# EAGLE design rotary-control (EAGLE 9.6.2)
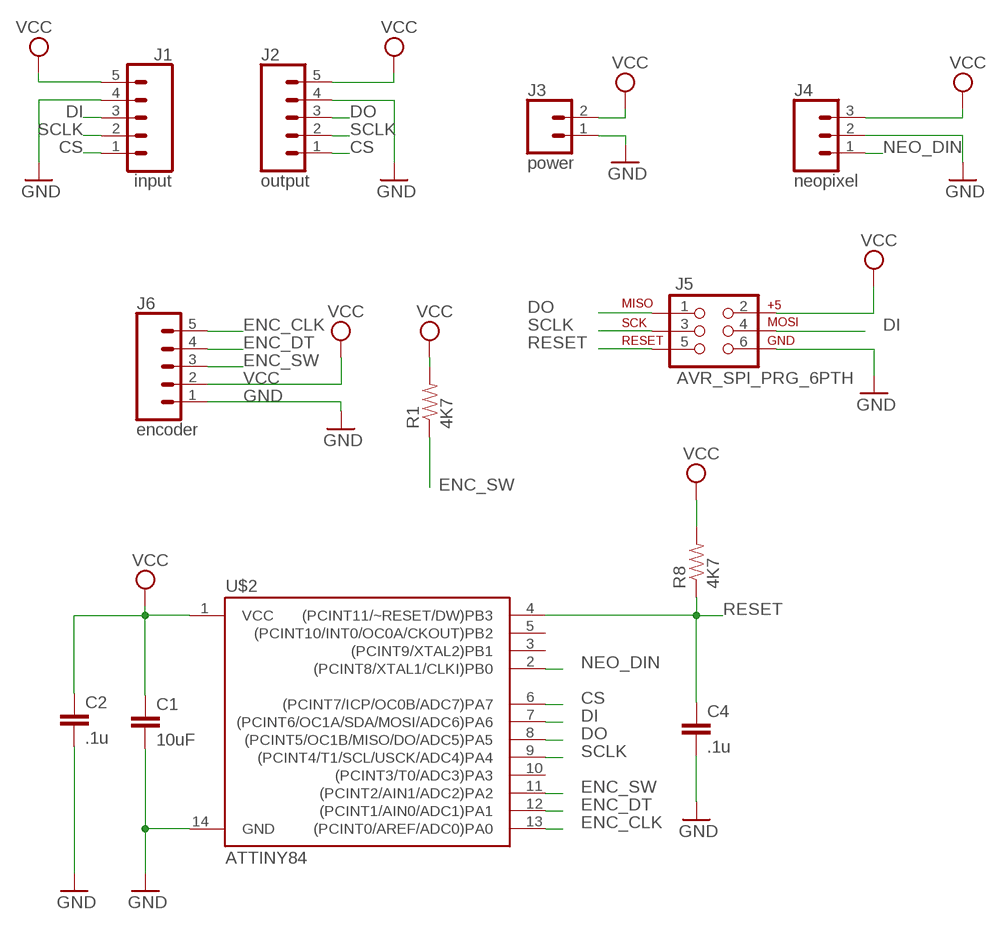
[diagram p0: schematic, sheet 1]

## Parts
C1  10uF  10UF-1206-6.3V-20%  [1206]
C2  .1u  CAP0805  [0805]
C4  .1u  CAP0805  [0805]
J1  input  CONN_05  [1X05]
J2  output  CONN_05  [1X05]
J3  power  CONN_02  [1X02]
J4  neopixel  CONN_03  [1X03]
J5  AVR_SPI_PRG_6PTH  [2X3]
J6  encoder  CONN_05  [1X05]
R1  4K7  RESISTOR  [0805]
R8  4K7  RESISTOR  [0805]
U$2  ATTINY84  [SO14]

## Nets
CS: J1.1 J2.1 U$2.6((PCINT7/ICP/OC0B/ADC7)PA7)
DI: J1.3 J5.4 U$2.7((PCINT6/OC1A/SDA/MOSI/ADC6)PA6)
DO: J2.3 J5.1 U$2.8((PCINT5/OC1B/MISO/DO/ADC5)PA5)
ENC_CLK: J6.5 U$2.13((PCINT0/AREF/ADC0)PA0)
ENC_DT: J6.4 U$2.12((PCINT1/AIN0/ADC1)PA1)
ENC_SW: J6.3 R1.1 U$2.11((PCINT2/AIN1/ADC2)PA2)
GND: C1.2 C2.2 C4.2 J1.4 J2.4 J3.1 J4.2 J5.6 J6.1 U$2.14(GND)
NEO_DIN: J4.1 U$2.2((PCINT8/XTAL1/CLKI)PB0)
RESET: C4.1 J5.5 R8.1 U$2.4((PCINT11/~RESET/DW)PB3)
SCLK: J1.2 J2.2 J5.3 U$2.9((PCINT4/T1/SCL/USCK/ADC4)PA4)
VCC: C1.1 C2.1 J1.5 J2.5 J3.2 J4.3 J5.2 J6.2 R1.2 R8.2 U$2.1(VCC)
Unconnected: U$2.3((PCINT9/XTAL2)PB1) U$2.5((PCINT10/INT0/OC0A/CKOUT)PB2) U$2.10((PCINT3/T0/ADC3)PA3)

## Library data of the parts
C1 = SparkFun-Capacitors:10UF: 10.0µF ceramic capacitors A capacitor is a passive two-terminal electrical component used to store electrical energy temporarily in an electric field.; PROD_ID: CAP-10057
C2 C4 = SparkFun:CAP: Capacitor Standard 0603 ceramic capacitor, and 0.1" leaded capacitor.
J1 J2 J6 = SparkFun-Connectors:CONN_05: Multi connection point. Often used as Generic Header-pin footprint for 0.1 inch spaced/style header connections On any of the 0.1 inch spaced packages, you can populate with these: Break Away Headers - Straight <https://www.sparkfun.com/products/116> (PRT-00116) Break Away Male Headers - Right Angle <https://www.sparkfun.com/products/553> (PRT-00553) Female Headers <https://www.sparkfun.com/products/115> (PRT-00115) Break Away Headers - Machine Pin <https://www.sparkfun.com/products/117> (PRT-00117) Break Away Female Headers - Swiss Machine Pin <https://www.sparkfun.com/products/743> (PRT-00743) For SCREWTERMINALS and SPRING TERMINALS visit here: Screw Terimnals on SparkFun.com <https://www.sparkfun.com/search/results?term=Screw+Terminals> (5mm/3.5mm/2.54mm spacing) This device is also useful as a general connection point to wire up your design to another part of your project. Our various solder wires solder well into these plated through hole pads. Hook-Up Wire - Assortment (Stranded, 22 AWG) <https://www.sparkfun.com/products/11375> (PRT-11375) Hook-Up Wire - Assortment (Solid Core, 22 AWG) <https://www.sparkfun.com/products/11367> (PRT-11367) View the entire wire category on our website here <https://www.sparkfun.com/categories/141> Special notes: Molex polarized connector foot print use with SKU : PRT-08231 with associated crimp pins and housings. 1MM SMD Version SKU: PRT-10208
J3 = SparkFun-Connectors:CONN_02: Multi connection point. Often used as Generic Header-pin footprint for 0.1 inch spaced/style header connections On any of the 0.1 inch spaced packages, you can populate with these: Break Away Headers - Straight <https://www.sparkfun.com/products/116> (PRT-00116) Break Away Male Headers - Right Angle <https://www.sparkfun.com/products/553> (PRT-00553) Female Headers <https://www.sparkfun.com/products/115> (PRT-00115) Break Away Headers - Machine Pin <https://www.sparkfun.com/products/117> (PRT-00117) Break Away Female Headers - Swiss Machine Pin <https://www.sparkfun.com/products/743> (PRT-00743) For SCREWTERMINALS and SPRING TERMINALS visit here: Screw Terimnals on SparkFun.com <https://www.sparkfun.com/search/results?term=Screw+Terminals> (5mm/3.5mm/2.54mm spacing) This device is also useful as a general connection point to wire up your design to another part of your project. Our various solder wires solder well into these plated through hole pads. Hook-Up Wire - Assortment (Stranded, 22 AWG) <https://www.sparkfun.com/products/11375> (PRT-11375) Hook-Up Wire - Assortment (Solid Core, 22 AWG) <https://www.sparkfun.com/products/11367> (PRT-11367) View the entire wire category on our website here <https://www.sparkfun.com/categories/141> Special notes: Molex polarized connector foot print use with: PRT-08233 with associated crimp pins and housings. 2.54_SCREWTERM for use with PRT-10571. 3.5mm Screw Terminal footprints for PRT-08084 5mm Screw Terminal footprints for use with PRT-08432
J4 = SparkFun-Connectors:CONN_03: Multi connection point. Often used as Generic Header-pin footprint for 0.1 inch spaced/style header connections On any of the 0.1 inch spaced packages, you can populate with these: Break Away Headers - Straight <https://www.sparkfun.com/products/116> (PRT-00116) Break Away Male Headers - Right Angle <https://www.sparkfun.com/products/553> (PRT-00553) Female Headers <https://www.sparkfun.com/products/115> (PRT-00115) Break Away Headers - Machine Pin <https://www.sparkfun.com/products/117> (PRT-00117) Break Away Female Headers - Swiss Machine Pin <https://www.sparkfun.com/products/743> (PRT-00743) Stackable Header - 3 Pin (Female, 0.1") <https://www.sparkfun.com/products/13875> (PRT-13875) For SCREWTERMINALS and SPRING TERMINALS visit here: Screw Terimnals on SparkFun.com <https://www.sparkfun.com/search/results?term=Screw+Terminals> (5mm/3.5mm/2.54mm spacing) This device is also useful as a general connection point to wire up your design to another part of your project. Our various solder wires solder well into these plated through hole pads. Hook-Up Wire - Assortment (Stranded, 22 AWG) <https://www.sparkfun.com/products/11375> (PRT-11375) Hook-Up Wire - Assortment (Solid Core, 22 AWG) <https://www.sparkfun.com/products/11367> (PRT-11367) View the entire wire category on our website here <https://www.sparkfun.com/categories/141> Special notes: Molex polarized connector foot print use with SKU : PRT-08232 with associated crimp pins and housings.
J5 = SparkFun-Connectors:AVR_SPI_PRG_6: AVR ISP 6 Pin This is the reduced ISP connector for AVR programming. Common on Arduino. This footprint will take up less PCB space and can be used with a 10-pin to 6-pin adapter such as SKU: BOB-08508
R1 R8 = SparkFun:RESISTOR: Resistor Basic schematic elements and footprints for 0603, 1206, and PTH 1/10th watt (small) resistors.
U$2 = SparkFun-IC-Microcontroller:ATTINY84: Atmel 14-pin 2/4/8kB flash uC Datasheet <https://cdn.sparkfun.com/datasheets/Widgets/doc8006.pdf> SparkFun Products Tiny AVR Programmer <https://www.sparkfun.com/products/11801> (PGM-11801) SparkFun Servo Trigger - Continuous Rotation <https://www.sparkfun.com/products/13872> (WIG-13872) SparkFun Servo Trigger <https://www.sparkfun.com/products/13118> (WIG-13118); PROD_ID: IC-11285

## Board
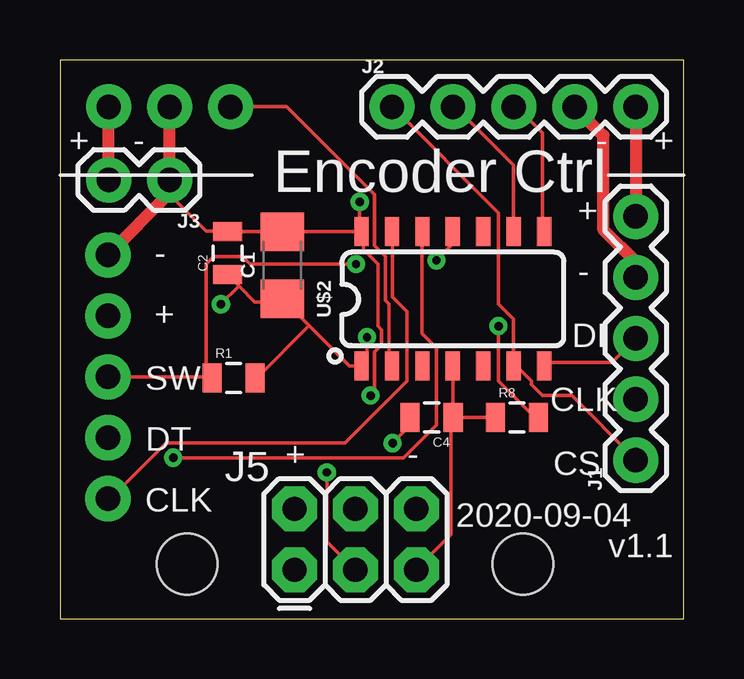
[diagram p1: board, top side]
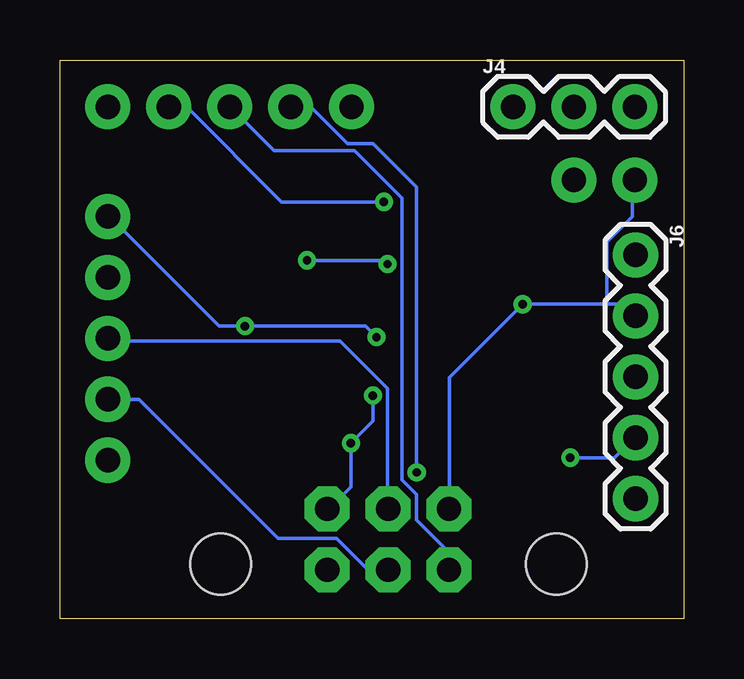
[diagram p2: board, bottom side, seen from below]

Size 26 x 23.29 mm. Coordinates in mm from the lower left corner, seen from the top.
Outline: 0,0 26,0 26,23.29 0,23.29 0,0
Copper layers (1*16): Top 0.035mm / dielectric 1.5mm / Bottom 0.035mm
Design rules "default": minimum track width 6mil, minimum drill 0.35mm, track to track 6mil, track to pad 6mil, pad to pad 6mil, via to via 6mil, smd to smd 6mil, copper to edge 40mil, drill to drill 6mil, minimum pad ring 10mil, minimum via ring 8mil, stop-mask expansion 4mil, vias tented up to drill 0mil, thermal gap 10mil
Holes 2.54 mm at 19.3,2.27 5.3,2.27

### Footprints (pad centres in the part's own frame; a part is rotated, then mirrored left to right if it is on the bottom)
1206 = smd 1.6 x 1.8: 1 -1.4,0; 2 1.4,0
0805 = smd 0.8 x 1.2: 1 -0.9,0; 2 0.9,0
1X05 = drill 1.016 pad 1.88: 1 0,0; 2 2.54,0; 3 5.08,0; 4 7.62,0; 5 10.16,0
1X02 = drill 1.016 pad 1.88: 1 0,0; 2 2.54,0
1X03 = drill 1.016 pad 1.88: 1 0,0; 2 2.54,0; 3 5.08,0
2X3 = drill 1.016 pad 1.88 octagon: 1 0,0; 2 0,2.54; 3 2.54,0; 4 2.54,2.54; 5 5.08,0; 6 5.08,2.54
SO14 = smd 0.6 x 1.2: 1 -3.175,-2.8; 2 -1.905,-2.8; 3 -0.635,-2.8; 4 0.635,-2.8; 5 1.905,-2.8; 6 3.175,-2.8; 7 4.445,-2.8; 8 4.445,2.8; 9 3.175,2.8; 10 1.905,2.8; 11 0.635,2.8; 12 -0.635,2.8; 13 -1.905,2.8; 14 -3.175,2.8

### Placement (x,y rotation side)
C1  9.27,14.73 90 top
C2  6.99,15.24 90 top
C4  15.49,8.38 180 top
J1  24,6.6 90 top
J2  13.84,21.34 0 top
J3  4.57,18.29 180 top
J4  7.11,21.34 0 bottom
J5  9.78,2.03 0 top
J6  2,15.16 270 bottom
R1  7.24,10.03 0 top
R8  19.05,8.38 0 top
U$2  15.75,13.34 0 top

### Tracks (layer width: path | path; a pad name or v marks a point on that pad's centre or on a via)
CS
  Top 0.152: J1.1 23.93,6.71 21.34,9.3 20.12,9.3 19.66,9.75 19.66,9.91 19.05,10.52 U$2.6 18.9,10.67 18.9,12.5 18.29,13.11 18.29,16.92 13.87,21.34 J2.1
DI
  Top 0.152: U$2.7 20.27,10.67 23.01,10.67 23.93,11.58 J1.3
  Bottom 0.152: J5.4 12.34,4.57 12.34,9.6 14.33,11.58 23.93,11.58 J1.3
DO
  Top 0.152: U$2.8 20.12,16.15 20.12,20.27 19.05,21.34 J2.3
  Bottom 0.152: J5.1 9.91,2.13 9.91,2.9 11.12,4.12 11.12,5.18 11.73,5.79 11.73,17.53 13.72,19.51 17.07,19.51 18.9,21.34 J2.3
ENC_CLK
  Top 0.152: U$2.13 13.87,16 13.87,13.41 14.48,12.8 14.48,9.91 11.89,7.32 4.42,7.32 2.13,5.03 J6.5
ENC_DT  (via drill 0.35)
  Top 0.152: v4.72,6.71 14.33,6.71 15.7,8.08 15.7,11.28 15.09,11.89 15.09,16 U$2.12
  Bottom 0.152: v4.72,6.71 2.9,6.71 2.13,7.47 J6.4
ENC_SW  (via drill 0.35)
  Top 0.152: J6.3 6.29,10.08 R1.1 6.1,10.06 6.1,14.78 6.4,15.09 7.62,15.09 7.92,14.78 v12.34,14.78 | v15.7,14.94 16.31,15.54 16.31,16 U$2.11
  Bottom 0.152: v15.7,14.94 12.5,14.94 v12.34,14.78
GND  (via drill 0.35)
  Top 0.152: C1.2 | C1.2 U$2.14 | C1.2 C2.2 6.86,16.15 6.1,16.15 4.72,17.53 J3.1 | v13.87,7.32 14.48,7.92 14.48,8.38 C4.2 | v12.95,9.3 13.11,9.45 13.11,11.12 13.41,11.43 13.41,12.04 13.26,12.19 13.26,14.78 12.65,15.39 12.65,16 U$2.14 | v12.5,17.37 12.5,16.15 U$2.14
  Top 0.508: J4.2 J3.1 4.57,17.73 J6.1 | J1.4 24,14.86 22.66,16.21 22.66,20.14 J2.4
  Bottom 0.152: J5.6 14.78,4.57 13.87,5.49 v13.87,7.32 12.95,8.23 v12.95,9.3 | J2.4 20.73,21.34 16.76,17.37 v12.5,17.37
NEO_DIN
  Top 0.152: J4.1 9.45,21.34 13.11,17.68 13.11,15.54 13.56,15.09 13.56,13.26 13.72,13.11 13.72,10.67 U$2.2
RESET
  Top 0.152: C4.1 16.39,10.52 U$2.4 | C4.1 R8.1 | C4.1 16.31,8.38 16.31,3.5 14.94,2.13 J5.5
SCLK  (via drill 0.35)
  Top 0.152: U$2.9 18.9,16.15 18.9,18.9 16.46,21.34 J2.2 | v11.12,6.1 11.12,3.2 12.19,2.13 J5.3
  Bottom 0.152: J1.2 22.71,9.14 16.92,3.35 14.48,3.35 13.26,2.13 12.34,2.13 J5.3 | J2.2 15.54,21.34 14.02,19.81 12.95,19.81 11.12,17.98 v11.12,6.1
VCC  (via drill 0.35)
  Top 0.152: C1.1 9.4,13.21 | 9.4,13.21 10.39,12.22 | 10.39,12.22 12.07,10.54 U$2.1 12.65,10.67 12.8,10.82 v12.8,11.73 | C2.1 7.46,13.86 | 7.46,13.86 8.12,13.21 9.4,13.21 | v18.29,12.19 18.29,9.91 19.81,8.38 R8.2 | 10.39,12.22 8.23,10.06 R1.2 | v6.71,13.11 7.46,13.86 | 7.47,13.87 7.46,13.86
  Top 0.508: J3.2 J4.3 | J2.5 J1.5
  Bottom 0.152: J1.5 23.93,16.76 19.36,12.19 v18.29,12.19 13.26,12.19 v12.8,11.73 | 3.2,13.11 2.59,13.11 2.13,12.65 J6.2 | 3.2,13.11 v6.71,13.11 9.75,10.06 9.75,4.57 J5.2 | 3.2,13.11 3.2,15.7 2.13,16.76 2.13,18.29 J3.2

### Text on the board
tPlace: + | - | - | + | Encoder Ctrl | + | - | - | + | DI | SW | CLK | DT | + | - | CS | CLK | 2020-09-04 | v1.1